# Altium schematic sheet VCA.SchDoc
size A4; SheetNumber: 2; SheetTotal: 2
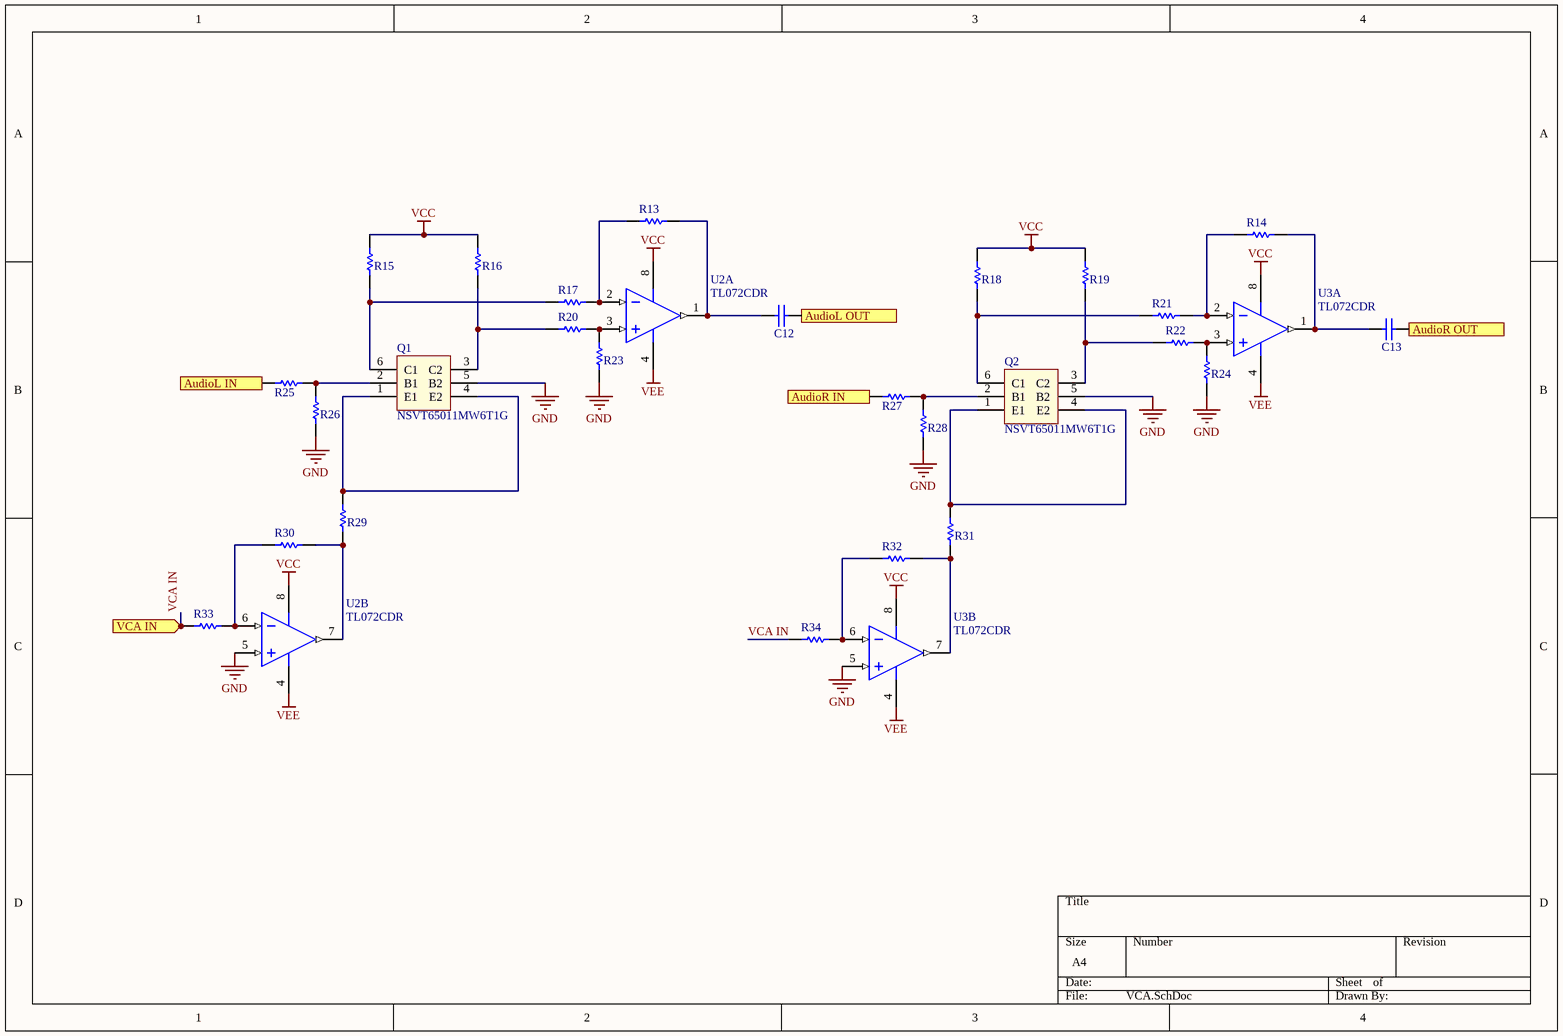
[diagram p0: VCA.SchDoc]

## Parts
C12  1206GC102KAT1A  [AVX-1206-2_L]  (value not drawn)
C13  1206GC102KAT1A  [AVX-1206-2_L]  (value not drawn)
Q1  NSVT65011MW6T1G  [NSVT65011MW6T1G]
Q2  NSVT65011MW6T1G  [NSVT65011MW6T1G]
R13  ERJ-8GEY0R00V  [RESC3216X70X50NL05T20]  (value not drawn)
R14  ERJ-8GEY0R00V  [RESC3216X70X50NL05T20]  (value not drawn)
R15  ERJ-8GEY0R00V  [RESC3216X70X50NL05T20]  (value not drawn)
R16  ERJ-8GEY0R00V  [RESC3216X70X50NL05T20]  (value not drawn)
R17  ERJ-8GEY0R00V  [RESC3216X70X50NL05T20]  (value not drawn)
R18  ERJ-8GEY0R00V  [RESC3216X70X50NL05T20]  (value not drawn)
R19  ERJ-8GEY0R00V  [RESC3216X70X50NL05T20]  (value not drawn)
R20  ERJ-8GEY0R00V  [RESC3216X70X50NL05T20]  (value not drawn)
R21  ERJ-8GEY0R00V  [RESC3216X70X50NL05T20]  (value not drawn)
R22  ERJ-8GEY0R00V  [RESC3216X70X50NL05T20]  (value not drawn)
R23  ERJ-8GEY0R00V  [RESC3216X70X50NL05T20]  (value not drawn)
R24  ERJ-8GEY0R00V  [RESC3216X70X50NL05T20]  (value not drawn)
R25  ERJ-8GEY0R00V  [RESC3216X70X50NL05T20]  (value not drawn)
R26  ERJ-8GEY0R00V  [RESC3216X70X50NL05T20]  (value not drawn)
R27  ERJ-8GEY0R00V  [RESC3216X70X50NL05T20]  (value not drawn)
R28  ERJ-8GEY0R00V  [RESC3216X70X50NL05T20]  (value not drawn)
R29  ERJ-8GEY0R00V  [RESC3216X70X50NL05T20]  (value not drawn)
R30  ERJ-8GEY0R00V  [RESC3216X70X50NL05T20]  (value not drawn)
R31  ERJ-8GEY0R00V  [RESC3216X70X50NL05T20]  (value not drawn)
R32  ERJ-8GEY0R00V  [RESC3216X70X50NL05T20]  (value not drawn)
R33  ERJ-8GEY0R00V  [RESC3216X70X50NL05T20]  (value not drawn)
R34  ERJ-8GEY0R00V  [RESC3216X70X50NL05T20]  (value not drawn)
U2  TL072CDR  [D0008A_M]  (parts A,B of 2)
U3  TL072CDR  [D0008A_M]  (parts A,B of 2)

## Ports
AudioL IN (in), AudioL OUT (out), AudioR IN (in), AudioR OUT (out), VCA IN (in)

## Nets
GND: Q1.5(B2) Q2.5(B2) R23.1 R24.1 R26.1 R28.1 U2.5(IN2+) U3.5(IN2+)
VCC: R15.2 R16.2 R18.2 R19.2 U2.8(VCC+) U3.8(VCC+)
VEE: U2.4(VCC-) U3.4(VCC-)
AudioL IN: R25.2 ; port AudioL IN
AudioL OUT: C12.2 ; port AudioL OUT
AudioR IN: R27.2 ; port AudioR IN
AudioR OUT: C13.2 ; port AudioR OUT
VCA IN: R33.1 R34.1 ; port VCA IN
NetC12_1: C12.1 R13.2 U2.1(OUT1)
NetC13_1: C13.1 R14.2 U3.1(OUT1)
NetQ1_1: Q1.1(E1) Q1.4(E2) R29.2
NetQ1_2: Q1.2(B1) R25.1 R26.2
NetQ1_3: Q1.3(C2) R16.1 R20.1
NetQ1_6: Q1.6(C1) R15.1 R17.1
NetQ2_1: Q2.1(E1) Q2.4(E2) R31.2
NetQ2_2: Q2.2(B1) R27.1 R28.2
NetQ2_3: Q2.3(C2) R19.1 R22.1
NetQ2_6: Q2.6(C1) R18.1 R21.1
NetR13_1: R13.1 R17.2 U2.2(IN1-)
NetR14_1: R14.1 R21.2 U3.2(IN1-)
NetR20_2: R20.2 R23.2 U2.3(IN1+)
NetR22_2: R22.2 R24.2 U3.3(IN1+)
NetR29_1: R29.1 R30.2 U2.7(OUT2)
NetR30_1: R30.1 R33.2 U2.6(IN2-)
NetR31_1: R31.1 R32.2 U3.7(OUT2)
NetR32_1: R32.1 R34.2 U3.6(IN2-)

## Library data of the parts
C12 C13 = CMP-2000-05468-1: Chip Capacitor, 1 nF, +/- 10%, -55 to 125 degC, 1206 (3216 Metric), RoHS, Tape and Reel; Manufacturer: AVX; Capacitance: 0.001uF; Dielectric: X7R; Voltage Rating DC: 2000V; Package Reference: 1206; Datasheet Version: 11/2010; Mounting Technology: SurfaceMount; Manufacturer URL: http://www.avx.com/; Tolerance: 10%; Tolerance (%): ±10%; PartNumber: 1206GC102KAT1A; Datasheet URL: https://datasheet.ciiva.com/11787/0900766b80ed4c37-11787781.pdf; Package Description: 2-Pin SMD, Body 3.4 x 1.8 mm; Case Size/Dimension: 1206; Rated Voltage: 2000V
R13-R34 = CMP-2003-00541-1: Manufacturer: Panasonic; Part Number: ERJ-8GEY0R00V
U2 U3 = CMP-0017-00628-2: Dual Low-Noise JFET-Input General-Purpose Operational Amplifier, 7 to 36 V, 0 to 70 degC, 8-pin SOIC (D8), Green (RoHS & no Sb/Br); Manufacturer: Texas Instruments; Total Supply Voltage(Min)(+5V is 5, +/-5V is 10): 7; IIB(Max)(pA): 200; Sub Family: General Purpose Amplifier, High Supply Voltage Amplifier (>=30V); Number of Channels: 2; Iq per channel(Max)(mA): 2.5; Total Supply Voltage(Max)(+5V is 5, +/-5V is 10): 36; Vio (25C)(Max)(mV): 10; Offset Drift(Typ)(uV/C): 18; CMRR(Min)(dB): 70; Rating: Catalog; Slew Rate(Typ)(V/us): 13; GBW(Typ)(MHz): 3; ComponentLink1Description: Manufacturer URL; Code_JEDEC: MS-012; ComponentLink3Description: Package Specification; Mounting Technology: Surface Mount; Eco-Plan: Green (RoHS & no Sb/Br); ComponentLink3URL: http://www.ti.com/litv/pdf/msoi002j; ComponentLink1URL: http://www.ti.com/; PackageVersion: 4040047-3/M, 06/2011; ComponentLink2URL: http://www.ti.com/lit/ds/symlink/tl072.pdf; PartNumber: TL072CDR; PackageDescription: 8-Pin Plastic Small Outline, Body 4.9 x 3.9 mm, Pitch 1.27 mm; DatasheetVersion: SLOS080J; Vn at 1kHz(Typ)(nV/rtHz): 18; ComponentLink2Description: Datasheet; PackageReference: D0008A